# Altium schematic sheet MCU.SchDoc
size A4; SheetNumber: 1; SheetTotal: 3
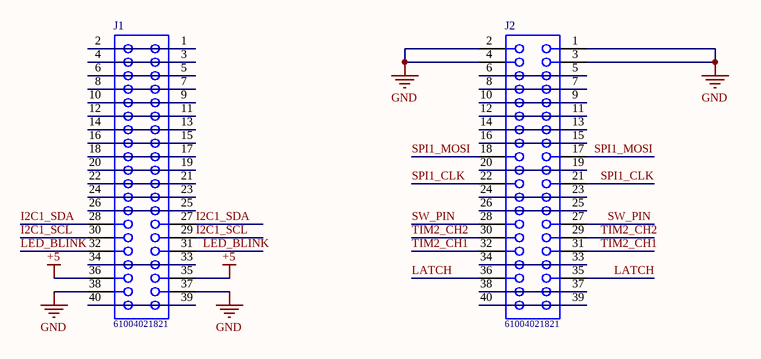
[diagram p0: MCU.SchDoc]

## Parts
J1  61004021821  [61004021821]
J2  61004021821  [61004021821]

## Nets
+5: J1.35 J1.36
GND: J1.37 J1.38 J2.1 J2.2 J2.3 J2.4
I2C1_SCL: J1.29 J1.30
I2C1_SDA: J1.27 J1.28
LATCH: J2.35 J2.36
LED_BLINK: J1.31 J1.32
SPI1_CLK: J2.21 J2.22
SPI1_MOSI: J2.17 J2.18
SW_PIN: J2.27 J2.28
TIM2_CH1: J2.31 J2.32
TIM2_CH2: J2.29 J2.30
NetJ1_1: J1.1 J1.2
NetJ1_3: J1.3 J1.4
NetJ1_5: J1.5 J1.6
NetJ1_7: J1.7 J1.8
NetJ1_9: J1.9 J1.10
NetJ1_11: J1.11 J1.12
NetJ1_13: J1.13 J1.14
NetJ1_15: J1.15 J1.16
NetJ1_17: J1.17 J1.18
NetJ1_19: J1.19 J1.20
NetJ1_21: J1.21 J1.22
NetJ1_23: J1.23 J1.24
NetJ1_25: J1.25 J1.26
NetJ1_33: J1.33 J1.34
NetJ1_39: J1.39 J1.40
NetJ2_5: J2.5 J2.6
NetJ2_7: J2.7 J2.8
NetJ2_9: J2.9 J2.10
NetJ2_11: J2.11 J2.12
NetJ2_13: J2.13 J2.14
NetJ2_15: J2.15 J2.16
NetJ2_19: J2.19 J2.20
NetJ2_23: J2.23 J2.24
NetJ2_25: J2.25 J2.26
NetJ2_33: J2.33 J2.34
NetJ2_37: J2.37 J2.38
NetJ2_39: J2.39 J2.40

## Library data of the parts
J1 J2 = 61004021821: WR-PHD Socket Header, SMT, pitch 2.54mm, Dual Row, Vertical, 40p; Manufacturer: Wurth Elektronik; Pin Number: 40; Rated Current: 3A; Working Voltage: 250VAC; Withstanding Voltage: 600VAC; Contact Resistance: 20mOhm; ComponentLink1Description: Manufacturer; ComponentLink1URL: http://www.we-online.de; ComponentLink2Description: Datasheet; ComponentLink2URL: https://www.we-online.com/catalog/datasheet/61004021821.pdf; Manufacturer Part Number: 61004021821; Published Date: May 2020; Pitch: 2.54mm; Operating Temperature: -40 to +105degC; Mounting Technology: SMT; Packaging: Tube; Gender: Socket Header; Row Number: Dual; Orientation: Vertical